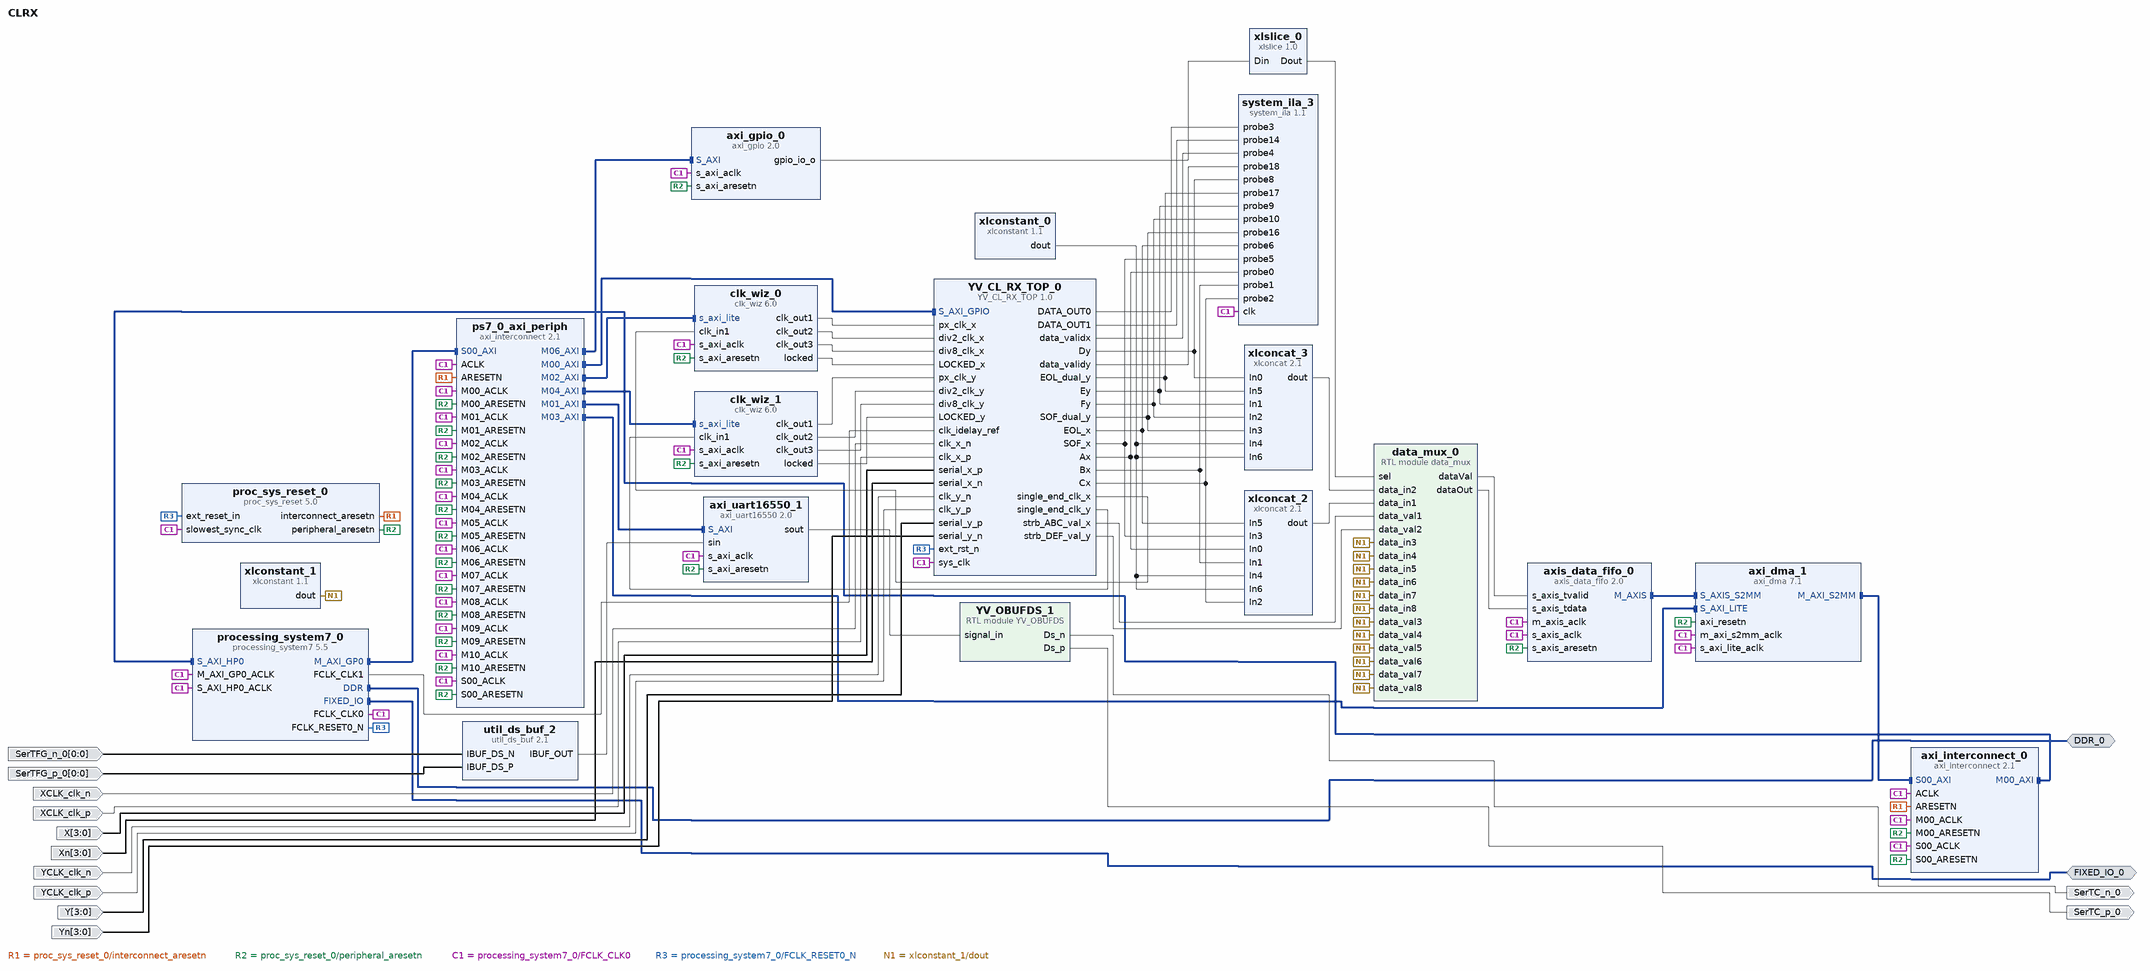
[diagram p0: block diagram of the top level]
# Vivado block design CLRX, xc7z020clg400-1, Vivado 2019.2
create_bd_design CLRX

create_bd_intf_port -mode Master -vlnv xilinx.com:interface:ddrx_rtl:1.0 DDR_0
create_bd_intf_port -mode Master -vlnv xilinx.com:display_processing_system7:fixedio_rtl:1.0 FIXED_IO_0
create_bd_port -dir O SerTC_n_0
create_bd_port -dir O SerTC_p_0
create_bd_port -dir I -from 0 -to 0 -type clk SerTFG_n_0
create_bd_port -dir I -from 0 -to 0 -type clk SerTFG_p_0
create_bd_port -dir I -from 3 -to 0 X
create_bd_port -dir I XCLK_clk_n
create_bd_port -dir I XCLK_clk_p
create_bd_port -dir I -from 3 -to 0 Xn
create_bd_port -dir I -from 3 -to 0 Y
create_bd_port -dir I YCLK_clk_n
create_bd_port -dir I YCLK_clk_p
create_bd_port -dir I -from 3 -to 0 Yn

create_bd_cell -type ip -vlnv YANTRAVISION:YV_CL:YV_CL_RX_TOP:1.0 YV_CL_RX_TOP_0
create_bd_cell -type module -reference YV_OBUFDS YV_OBUFDS_1
create_bd_cell -type ip -vlnv xilinx.com:ip:axi_dma:7.1 axi_dma_1
set_property -dict [list \
  CONFIG.c_include_mm2s 0 \
  CONFIG.c_include_sg 0 \
  CONFIG.c_s2mm_burst_size 256 \
  CONFIG.c_sg_length_width 24 \
] [get_bd_cells axi_dma_1]
create_bd_cell -type ip -vlnv xilinx.com:ip:axi_gpio:2.0 axi_gpio_0
set_property -dict {CONFIG.C_ALL_OUTPUTS 1 CONFIG.C_IS_DUAL 0} [get_bd_cells axi_gpio_0]
create_bd_cell -type ip -vlnv xilinx.com:ip:axi_interconnect:2.1 axi_interconnect_0
set_property -dict {CONFIG.NUM_MI 1 CONFIG.S00_HAS_DATA_FIFO 1 CONFIG.S00_HAS_REGSLICE 4} [get_bd_cells axi_interconnect_0]
create_bd_cell -type ip -vlnv xilinx.com:ip:axi_uart16550:2.0 axi_uart16550_1
create_bd_cell -type ip -vlnv xilinx.com:ip:axis_data_fifo:2.0 axis_data_fifo_0
set_property -dict {CONFIG.FIFO_DEPTH 4096 CONFIG.IS_ACLK_ASYNC 1 CONFIG.TDATA_NUM_BYTES 4} [get_bd_cells axis_data_fifo_0]
create_bd_cell -type ip -vlnv xilinx.com:ip:clk_wiz:6.0 clk_wiz_0
set_property -dict [list \
  CONFIG.AXI_DRP true \
  CONFIG.CLKOUT2_JITTER 130.958 \
  CONFIG.CLKOUT2_PHASE_ERROR 98.575 \
  CONFIG.CLKOUT2_USED true \
  CONFIG.CLKOUT3_JITTER 130.958 \
  CONFIG.CLKOUT3_PHASE_ERROR 98.575 \
  CONFIG.CLKOUT3_USED true \
  CONFIG.MMCM_CLKOUT1_DIVIDE 10 \
  CONFIG.MMCM_CLKOUT2_DIVIDE 10 \
  CONFIG.MMCM_DIVCLK_DIVIDE 1 \
  CONFIG.NUM_OUT_CLKS 3 \
  CONFIG.USE_DYN_RECONFIG true \
] [get_bd_cells clk_wiz_0]
create_bd_cell -type ip -vlnv xilinx.com:ip:clk_wiz:6.0 clk_wiz_1
set_property -dict [list \
  CONFIG.AXI_DRP true \
  CONFIG.CLKOUT2_JITTER 130.958 \
  CONFIG.CLKOUT2_PHASE_ERROR 98.575 \
  CONFIG.CLKOUT2_USED true \
  CONFIG.CLKOUT3_JITTER 130.958 \
  CONFIG.CLKOUT3_PHASE_ERROR 98.575 \
  CONFIG.CLKOUT3_USED true \
  CONFIG.MMCM_CLKOUT1_DIVIDE 10 \
  CONFIG.MMCM_CLKOUT2_DIVIDE 10 \
  CONFIG.MMCM_DIVCLK_DIVIDE 1 \
  CONFIG.NUM_OUT_CLKS 3 \
  CONFIG.USE_DYN_RECONFIG true \
] [get_bd_cells clk_wiz_1]
create_bd_cell -type module -reference data_mux data_mux_0
create_bd_cell -type ip -vlnv xilinx.com:ip:proc_sys_reset:5.0 proc_sys_reset_0
create_bd_cell -type ip -vlnv xilinx.com:ip:processing_system7:5.5 processing_system7_0
set_property -dict [list \
  CONFIG.PCW_APU_PERIPHERAL_FREQMHZ 666.666666 \
  CONFIG.PCW_ENET0_ENET0_IO {MIO 16 .. 27} \
  CONFIG.PCW_ENET0_GRP_MDIO_ENABLE 1 \
  CONFIG.PCW_ENET0_GRP_MDIO_IO {MIO 52 .. 53} \
  CONFIG.PCW_ENET0_PERIPHERAL_ENABLE 1 \
  CONFIG.PCW_ENET0_RESET_ENABLE 0 \
  CONFIG.PCW_ENET_RESET_ENABLE 1 \
  CONFIG.PCW_ENET_RESET_SELECT {Share reset pin} \
  CONFIG.PCW_EN_CLK1_PORT 1 \
  CONFIG.PCW_FCLK_CLK1_BUF TRUE \
  CONFIG.PCW_FPGA0_PERIPHERAL_FREQMHZ 100 \
  CONFIG.PCW_FPGA1_PERIPHERAL_FREQMHZ 200 \
  CONFIG.PCW_FPGA_FCLK1_ENABLE 1 \
  CONFIG.PCW_GP0_EN_MODIFIABLE_TXN 0 \
  CONFIG.PCW_GP1_EN_MODIFIABLE_TXN 0 \
  CONFIG.PCW_GPIO_EMIO_GPIO_ENABLE 1 \
  CONFIG.PCW_GPIO_EMIO_GPIO_IO 1 \
  CONFIG.PCW_GPIO_EMIO_GPIO_WIDTH 1 \
  CONFIG.PCW_GPIO_MIO_GPIO_ENABLE 1 \
  CONFIG.PCW_GPIO_MIO_GPIO_IO MIO \
  CONFIG.PCW_I2C0_GRP_INT_ENABLE 0 \
  CONFIG.PCW_I2C0_I2C0_IO {MIO 46 .. 47} \
  CONFIG.PCW_I2C0_PERIPHERAL_ENABLE 1 \
  CONFIG.PCW_I2C_PERIPHERAL_FREQMHZ 111.111115 \
  CONFIG.PCW_I2C_RESET_ENABLE 0 \
  CONFIG.PCW_IRQ_F2P_INTR 1 \
  CONFIG.PCW_PERIPHERAL_BOARD_PRESET None \
  CONFIG.PCW_PRESET_BANK1_VOLTAGE {LVCMOS 1.8V} \
  CONFIG.PCW_QSPI_GRP_SINGLE_SS_ENABLE 1 \
  CONFIG.PCW_QSPI_GRP_SINGLE_SS_IO {MIO 1 .. 6} \
  CONFIG.PCW_QSPI_PERIPHERAL_ENABLE 1 \
  CONFIG.PCW_QSPI_QSPI_IO {MIO 1 .. 6} \
  CONFIG.PCW_SD0_GRP_CD_ENABLE 1 \
  CONFIG.PCW_SD0_GRP_CD_IO {MIO 48} \
  CONFIG.PCW_SD0_GRP_WP_ENABLE 0 \
  CONFIG.PCW_SD0_PERIPHERAL_ENABLE 1 \
  CONFIG.PCW_SD0_SD0_IO {MIO 40 .. 45} \
  CONFIG.PCW_SD1_PERIPHERAL_ENABLE 1 \
  CONFIG.PCW_SD1_SD1_IO {MIO 10 .. 15} \
  CONFIG.PCW_SDIO_PERIPHERAL_FREQMHZ 100 \
  CONFIG.PCW_SINGLE_QSPI_DATA_MODE x4 \
  CONFIG.PCW_S_AXI_HP0_DATA_WIDTH 32 \
  CONFIG.PCW_UART0_PERIPHERAL_ENABLE 1 \
  CONFIG.PCW_UART0_UART0_IO {MIO 50 .. 51} \
  CONFIG.PCW_UART1_PERIPHERAL_ENABLE 0 \
  CONFIG.PCW_UART_PERIPHERAL_FREQMHZ 100 \
  CONFIG.PCW_UIPARAM_DDR_FREQ_MHZ 533.333333 \
  CONFIG.PCW_UIPARAM_DDR_MEMORY_TYPE {DDR 3 (Low Voltage)} \
  CONFIG.PCW_UIPARAM_DDR_PARTNO Custom \
  CONFIG.PCW_USB0_PERIPHERAL_ENABLE 1 \
  CONFIG.PCW_USB0_RESET_ENABLE 0 \
  CONFIG.PCW_USB0_USB0_IO {MIO 28 .. 39} \
  CONFIG.PCW_USB_RESET_ENABLE 1 \
  CONFIG.PCW_USB_RESET_SELECT {Share reset pin} \
  CONFIG.PCW_USE_FABRIC_INTERRUPT 1 \
  CONFIG.PCW_USE_S_AXI_HP0 1 \
] [get_bd_cells processing_system7_0]
# 524 more settings of processing_system7_0 are not shown: defaults, MIO pin electricals, DDR timing, and values the tool derives
create_bd_cell -type ip -vlnv xilinx.com:ip:axi_interconnect:2.1 ps7_0_axi_periph
set_property -dict {CONFIG.NUM_MI 11 CONFIG.SYNCHRONIZATION_STAGES 2} [get_bd_cells ps7_0_axi_periph]
create_bd_cell -type ip -vlnv xilinx.com:ip:system_ila:1.1 system_ila_3
set_property -dict [list \
  CONFIG.C_DATA_DEPTH 4096 \
  CONFIG.C_MON_TYPE NATIVE \
  CONFIG.C_NUM_OF_PROBES 20 \
  CONFIG.C_PROBE0_WIDTH 8 \
  CONFIG.C_PROBE10_WIDTH 8 \
  CONFIG.C_PROBE11_WIDTH 8 \
  CONFIG.C_PROBE12_WIDTH 8 \
  CONFIG.C_PROBE13_WIDTH 8 \
  CONFIG.C_PROBE14_WIDTH 28 \
  CONFIG.C_PROBE15_WIDTH 28 \
  CONFIG.C_PROBE16_WIDTH 1 \
  CONFIG.C_PROBE17_WIDTH 1 \
  CONFIG.C_PROBE1_WIDTH 8 \
  CONFIG.C_PROBE2_WIDTH 8 \
  CONFIG.C_PROBE3_WIDTH 28 \
  CONFIG.C_PROBE8_WIDTH 8 \
  CONFIG.C_PROBE9_WIDTH 8 \
  CONFIG.C_PROBE_WIDTH_PROPAGATION MANUAL \
] [get_bd_cells system_ila_3]
create_bd_cell -type ip -vlnv xilinx.com:ip:util_ds_buf:2.1 util_ds_buf_2
set_property -dict {CONFIG.C_BUF_TYPE IBUFDS} [get_bd_cells util_ds_buf_2]
create_bd_cell -type ip -vlnv xilinx.com:ip:xlconcat:2.1 xlconcat_2
set_property -dict [list \
  CONFIG.IN0_WIDTH 8 \
  CONFIG.IN1_WIDTH 8 \
  CONFIG.IN2_WIDTH 8 \
  CONFIG.IN3_WIDTH 1 \
  CONFIG.IN4_WIDTH 3 \
  CONFIG.IN5_WIDTH 1 \
  CONFIG.IN6_WIDTH 3 \
  CONFIG.NUM_PORTS 7 \
] [get_bd_cells xlconcat_2]
create_bd_cell -type ip -vlnv xilinx.com:ip:xlconcat:2.1 xlconcat_3
set_property -dict [list \
  CONFIG.IN0_WIDTH 8 \
  CONFIG.IN1_WIDTH 8 \
  CONFIG.IN2_WIDTH 8 \
  CONFIG.IN3_WIDTH 1 \
  CONFIG.IN4_WIDTH 3 \
  CONFIG.IN5_WIDTH 1 \
  CONFIG.IN6_WIDTH 3 \
  CONFIG.NUM_PORTS 7 \
] [get_bd_cells xlconcat_3]
create_bd_cell -type ip -vlnv xilinx.com:ip:xlconstant:1.1 xlconstant_0
set_property -dict {CONFIG.CONST_VAL 0 CONFIG.CONST_WIDTH 3} [get_bd_cells xlconstant_0]
create_bd_cell -type ip -vlnv xilinx.com:ip:xlconstant:1.1 xlconstant_1
set_property -dict {CONFIG.CONST_VAL 0 CONFIG.CONST_WIDTH 32} [get_bd_cells xlconstant_1]
create_bd_cell -type ip -vlnv xilinx.com:ip:xlslice:1.0 xlslice_0
set_property -dict {CONFIG.DIN_FROM 3 CONFIG.DOUT_WIDTH 4} [get_bd_cells xlslice_0]

# ---- connections ----

connect_bd_intf_net [get_bd_intf_pins processing_system7_0/M_AXI_GP0] [get_bd_intf_pins ps7_0_axi_periph/S00_AXI]
connect_bd_intf_net [get_bd_intf_pins axi_interconnect_0/M00_AXI] [get_bd_intf_pins processing_system7_0/S_AXI_HP0]
connect_bd_intf_net -intf_net processing_system7_1_DDR [get_bd_intf_ports DDR_0] [get_bd_intf_pins processing_system7_0/DDR]
connect_bd_intf_net [get_bd_intf_pins axi_dma_1/S_AXIS_S2MM] [get_bd_intf_pins axis_data_fifo_0/M_AXIS]
connect_bd_intf_net [get_bd_intf_pins axi_dma_1/M_AXI_S2MM] [get_bd_intf_pins axi_interconnect_0/S00_AXI]
connect_bd_intf_net -intf_net processing_system7_1_FIXED_IO [get_bd_intf_ports FIXED_IO_0] [get_bd_intf_pins processing_system7_0/FIXED_IO]
connect_bd_intf_net [get_bd_intf_pins axi_dma_1/S_AXI_LITE] [get_bd_intf_pins ps7_0_axi_periph/M03_AXI]
connect_bd_intf_net [get_bd_intf_pins YV_CL_RX_TOP_0/S_AXI_GPIO] [get_bd_intf_pins ps7_0_axi_periph/M00_AXI]
connect_bd_intf_net [get_bd_intf_pins axi_uart16550_1/S_AXI] [get_bd_intf_pins ps7_0_axi_periph/M01_AXI]
connect_bd_intf_net [get_bd_intf_pins clk_wiz_0/s_axi_lite] [get_bd_intf_pins ps7_0_axi_periph/M02_AXI]
connect_bd_intf_net [get_bd_intf_pins clk_wiz_1/s_axi_lite] [get_bd_intf_pins ps7_0_axi_periph/M04_AXI]
connect_bd_intf_net [get_bd_intf_pins axi_gpio_0/S_AXI] [get_bd_intf_pins ps7_0_axi_periph/M06_AXI]
connect_bd_net -net ARESETN_1 [get_bd_pins proc_sys_reset_0/interconnect_aresetn] \
  [get_bd_pins axi_interconnect_0/ARESETN] [get_bd_pins ps7_0_axi_periph/ARESETN]
connect_bd_net -net IBUF_DS_N_0_1 [get_bd_ports SerTFG_n_0] [get_bd_pins util_ds_buf_2/IBUF_DS_N]
connect_bd_net -net IBUF_DS_P_0_1 [get_bd_ports SerTFG_p_0] [get_bd_pins util_ds_buf_2/IBUF_DS_P]
connect_bd_net -net M00_ARESETN_1 [get_bd_pins proc_sys_reset_0/peripheral_aresetn] \
  [get_bd_pins axi_dma_1/axi_resetn] [get_bd_pins axi_gpio_0/s_axi_aresetn] [get_bd_pins axi_interconnect_0/M00_ARESETN] \
  [get_bd_pins axi_interconnect_0/S00_ARESETN] [get_bd_pins axi_uart16550_1/s_axi_aresetn] \
  [get_bd_pins axis_data_fifo_0/s_axis_aresetn] [get_bd_pins clk_wiz_0/s_axi_aresetn] [get_bd_pins clk_wiz_1/s_axi_aresetn] \
  [get_bd_pins ps7_0_axi_periph/M00_ARESETN] [get_bd_pins ps7_0_axi_periph/M01_ARESETN] \
  [get_bd_pins ps7_0_axi_periph/M02_ARESETN] [get_bd_pins ps7_0_axi_periph/M03_ARESETN] \
  [get_bd_pins ps7_0_axi_periph/M04_ARESETN] [get_bd_pins ps7_0_axi_periph/M05_ARESETN] \
  [get_bd_pins ps7_0_axi_periph/M06_ARESETN] [get_bd_pins ps7_0_axi_periph/M07_ARESETN] \
  [get_bd_pins ps7_0_axi_periph/M08_ARESETN] [get_bd_pins ps7_0_axi_periph/M09_ARESETN] \
  [get_bd_pins ps7_0_axi_periph/M10_ARESETN] [get_bd_pins ps7_0_axi_periph/S00_ARESETN]
connect_bd_net [get_bd_pins processing_system7_0/FCLK_CLK0] \
  [get_bd_pins YV_CL_RX_TOP_0/sys_clk] [get_bd_pins axi_dma_1/m_axi_s2mm_aclk] [get_bd_pins axi_dma_1/s_axi_lite_aclk] \
  [get_bd_pins axi_gpio_0/s_axi_aclk] [get_bd_pins axi_interconnect_0/ACLK] [get_bd_pins axi_interconnect_0/M00_ACLK] \
  [get_bd_pins axi_interconnect_0/S00_ACLK] [get_bd_pins axi_uart16550_1/s_axi_aclk] \
  [get_bd_pins axis_data_fifo_0/m_axis_aclk] [get_bd_pins axis_data_fifo_0/s_axis_aclk] [get_bd_pins clk_wiz_0/s_axi_aclk] \
  [get_bd_pins clk_wiz_1/s_axi_aclk] [get_bd_pins proc_sys_reset_0/slowest_sync_clk] \
  [get_bd_pins processing_system7_0/M_AXI_GP0_ACLK] [get_bd_pins processing_system7_0/S_AXI_HP0_ACLK] \
  [get_bd_pins ps7_0_axi_periph/ACLK] [get_bd_pins ps7_0_axi_periph/M00_ACLK] [get_bd_pins ps7_0_axi_periph/M01_ACLK] \
  [get_bd_pins ps7_0_axi_periph/M02_ACLK] [get_bd_pins ps7_0_axi_periph/M03_ACLK] [get_bd_pins ps7_0_axi_periph/M04_ACLK] \
  [get_bd_pins ps7_0_axi_periph/M05_ACLK] [get_bd_pins ps7_0_axi_periph/M06_ACLK] [get_bd_pins ps7_0_axi_periph/M07_ACLK] \
  [get_bd_pins ps7_0_axi_periph/M08_ACLK] [get_bd_pins ps7_0_axi_periph/M09_ACLK] [get_bd_pins ps7_0_axi_periph/M10_ACLK] \
  [get_bd_pins ps7_0_axi_periph/S00_ACLK] [get_bd_pins system_ila_3/clk]
connect_bd_net -net XCLK_clk_n_0_1 [get_bd_ports XCLK_clk_n] [get_bd_pins YV_CL_RX_TOP_0/clk_x_n]
connect_bd_net -net XCLK_clk_p_0_1 [get_bd_ports XCLK_clk_p] [get_bd_pins YV_CL_RX_TOP_0/clk_x_p]
connect_bd_net -net X_0_1 [get_bd_ports X] [get_bd_pins YV_CL_RX_TOP_0/serial_x_p]
connect_bd_net -net Xn_0_1 [get_bd_ports Xn] [get_bd_pins YV_CL_RX_TOP_0/serial_x_n]
connect_bd_net [get_bd_ports YCLK_clk_n] [get_bd_pins YV_CL_RX_TOP_0/clk_y_n]
connect_bd_net [get_bd_ports YCLK_clk_p] [get_bd_pins YV_CL_RX_TOP_0/clk_y_p]
connect_bd_net [get_bd_pins YV_CL_RX_TOP_0/DATA_OUT0] [get_bd_pins system_ila_3/probe3]
connect_bd_net [get_bd_pins YV_CL_RX_TOP_0/DATA_OUT1] [get_bd_pins system_ila_3/probe14]
connect_bd_net [get_bd_pins YV_CL_RX_TOP_0/Dy] [get_bd_pins system_ila_3/probe8] [get_bd_pins xlconcat_3/In0]
connect_bd_net [get_bd_pins YV_CL_RX_TOP_0/EOL_dual_y] [get_bd_pins system_ila_3/probe17] [get_bd_pins xlconcat_3/In5]
connect_bd_net [get_bd_pins YV_CL_RX_TOP_0/EOL_x] [get_bd_pins system_ila_3/probe6] [get_bd_pins xlconcat_2/In5]
connect_bd_net [get_bd_pins YV_CL_RX_TOP_0/Ey] [get_bd_pins system_ila_3/probe9] [get_bd_pins xlconcat_3/In1]
connect_bd_net [get_bd_pins YV_CL_RX_TOP_0/Fy] [get_bd_pins system_ila_3/probe10] [get_bd_pins xlconcat_3/In2]
connect_bd_net [get_bd_pins YV_CL_RX_TOP_0/SOF_dual_y] [get_bd_pins system_ila_3/probe16] [get_bd_pins xlconcat_3/In3]
connect_bd_net [get_bd_pins YV_CL_RX_TOP_0/SOF_x] [get_bd_pins system_ila_3/probe5] [get_bd_pins xlconcat_2/In3]
connect_bd_net [get_bd_pins YV_CL_RX_TOP_0/data_validx] [get_bd_pins system_ila_3/probe4]
connect_bd_net [get_bd_pins YV_CL_RX_TOP_0/data_validy] [get_bd_pins system_ila_3/probe18]
connect_bd_net [get_bd_pins YV_CL_RX_TOP_0/single_end_clk_y] [get_bd_pins clk_wiz_1/clk_in1]
connect_bd_net -net YV_CL_RX_TOP_0_strb_ABC_val_x [get_bd_pins data_mux_0/dataVal] [get_bd_pins axis_data_fifo_0/s_axis_tvalid]
connect_bd_net [get_bd_pins YV_CL_RX_TOP_0/strb_ABC_val_x] [get_bd_pins data_mux_0/data_val1]
connect_bd_net [get_bd_pins YV_CL_RX_TOP_0/strb_DEF_val_y] [get_bd_pins data_mux_0/data_val2]
connect_bd_net [get_bd_pins YV_OBUFDS_1/Ds_n] [get_bd_ports SerTC_n_0]
connect_bd_net [get_bd_pins YV_OBUFDS_1/Ds_p] [get_bd_ports SerTC_p_0]
connect_bd_net -net YV_Vision_KIT_0_Ax_0 [get_bd_pins YV_CL_RX_TOP_0/Ax] [get_bd_pins system_ila_3/probe0] [get_bd_pins xlconcat_2/In0]
connect_bd_net -net YV_Vision_KIT_0_Bx_0 [get_bd_pins YV_CL_RX_TOP_0/Bx] [get_bd_pins system_ila_3/probe1] [get_bd_pins xlconcat_2/In1]
connect_bd_net -net YV_Vision_KIT_0_Cx_0 [get_bd_pins YV_CL_RX_TOP_0/Cx] [get_bd_pins system_ila_3/probe2] [get_bd_pins xlconcat_2/In2]
connect_bd_net -net YV_Vision_KIT_0_singel_end_clk_x [get_bd_pins YV_CL_RX_TOP_0/single_end_clk_x] [get_bd_pins clk_wiz_0/clk_in1]
connect_bd_net [get_bd_ports Y] [get_bd_pins YV_CL_RX_TOP_0/serial_y_p]
connect_bd_net [get_bd_ports Yn] [get_bd_pins YV_CL_RX_TOP_0/serial_y_n]
connect_bd_net [get_bd_pins axi_gpio_0/gpio_io_o] [get_bd_pins xlslice_0/Din]
connect_bd_net [get_bd_pins axi_uart16550_1/sout] [get_bd_pins YV_OBUFDS_1/signal_in]
connect_bd_net [get_bd_pins clk_wiz_0/clk_out1] [get_bd_pins YV_CL_RX_TOP_0/px_clk_x]
connect_bd_net [get_bd_pins clk_wiz_0/clk_out2] [get_bd_pins YV_CL_RX_TOP_0/div2_clk_x]
connect_bd_net [get_bd_pins clk_wiz_0/clk_out3] [get_bd_pins YV_CL_RX_TOP_0/div8_clk_x]
connect_bd_net [get_bd_pins clk_wiz_0/locked] [get_bd_pins YV_CL_RX_TOP_0/LOCKED_x]
connect_bd_net [get_bd_pins clk_wiz_1/clk_out1] [get_bd_pins YV_CL_RX_TOP_0/px_clk_y]
connect_bd_net [get_bd_pins clk_wiz_1/clk_out2] [get_bd_pins YV_CL_RX_TOP_0/div2_clk_y]
connect_bd_net [get_bd_pins clk_wiz_1/clk_out3] [get_bd_pins YV_CL_RX_TOP_0/div8_clk_y]
connect_bd_net [get_bd_pins clk_wiz_1/locked] [get_bd_pins YV_CL_RX_TOP_0/LOCKED_y]
connect_bd_net [get_bd_pins data_mux_0/dataOut] [get_bd_pins axis_data_fifo_0/s_axis_tdata]
connect_bd_net [get_bd_pins processing_system7_0/FCLK_RESET0_N] [get_bd_pins YV_CL_RX_TOP_0/ext_rst_n] [get_bd_pins proc_sys_reset_0/ext_reset_in]
connect_bd_net -net processing_system7_1_FCLK_CLK1 [get_bd_pins processing_system7_0/FCLK_CLK1] [get_bd_pins YV_CL_RX_TOP_0/clk_idelay_ref]
connect_bd_net [get_bd_pins util_ds_buf_2/IBUF_OUT] [get_bd_pins axi_uart16550_1/sin]
connect_bd_net [get_bd_pins xlconcat_2/dout] [get_bd_pins data_mux_0/data_in1]
connect_bd_net [get_bd_pins xlconcat_3/dout] [get_bd_pins data_mux_0/data_in2]
connect_bd_net [get_bd_pins xlconstant_0/dout] \
  [get_bd_pins xlconcat_2/In4] [get_bd_pins xlconcat_2/In6] [get_bd_pins xlconcat_3/In4] [get_bd_pins xlconcat_3/In6]
connect_bd_net [get_bd_pins xlconstant_1/dout] \
  [get_bd_pins data_mux_0/data_in3] [get_bd_pins data_mux_0/data_in4] [get_bd_pins data_mux_0/data_in5] \
  [get_bd_pins data_mux_0/data_in6] [get_bd_pins data_mux_0/data_in7] [get_bd_pins data_mux_0/data_in8] \
  [get_bd_pins data_mux_0/data_val3] [get_bd_pins data_mux_0/data_val4] [get_bd_pins data_mux_0/data_val5] \
  [get_bd_pins data_mux_0/data_val6] [get_bd_pins data_mux_0/data_val7] [get_bd_pins data_mux_0/data_val8]
connect_bd_net [get_bd_pins xlslice_0/Dout] [get_bd_pins data_mux_0/sel]

# ---- address map ----
assign_bd_address -offset 0x00000000 -range 1G -target_address_space [get_bd_addr_spaces axi_dma_1/Data_S2MM] [get_bd_addr_segs processing_system7_0/S_AXI_HP0/HP0_DDR_LOWOCM]
assign_bd_address -offset 0x40400000 -range 64K -target_address_space [get_bd_addr_spaces processing_system7_0/Data] [get_bd_addr_segs axi_dma_1/S_AXI_LITE/Reg]
assign_bd_address -offset 0x41200000 -range 64K -target_address_space [get_bd_addr_spaces processing_system7_0/Data] [get_bd_addr_segs axi_gpio_0/S_AXI/Reg]
assign_bd_address -offset 0x43C00000 -range 64K -target_address_space [get_bd_addr_spaces processing_system7_0/Data] [get_bd_addr_segs YV_CL_RX_TOP_0/S_AXI_GPIO/reg0]
assign_bd_address -offset 0x43C10000 -range 64K -target_address_space [get_bd_addr_spaces processing_system7_0/Data] [get_bd_addr_segs axi_uart16550_1/S_AXI/Reg]
assign_bd_address -offset 0x43C20000 -range 64K -target_address_space [get_bd_addr_spaces processing_system7_0/Data] [get_bd_addr_segs clk_wiz_0/s_axi_lite/Reg]
assign_bd_address -offset 0x43C30000 -range 64K -target_address_space [get_bd_addr_spaces processing_system7_0/Data] [get_bd_addr_segs clk_wiz_1/s_axi_lite/Reg]

validate_bd_design
save_bd_design
